# Altium schematic sheet 1_AASTM32-Power.SchDoc
size A4; SheetNumber: 2; SheetTotal: 4
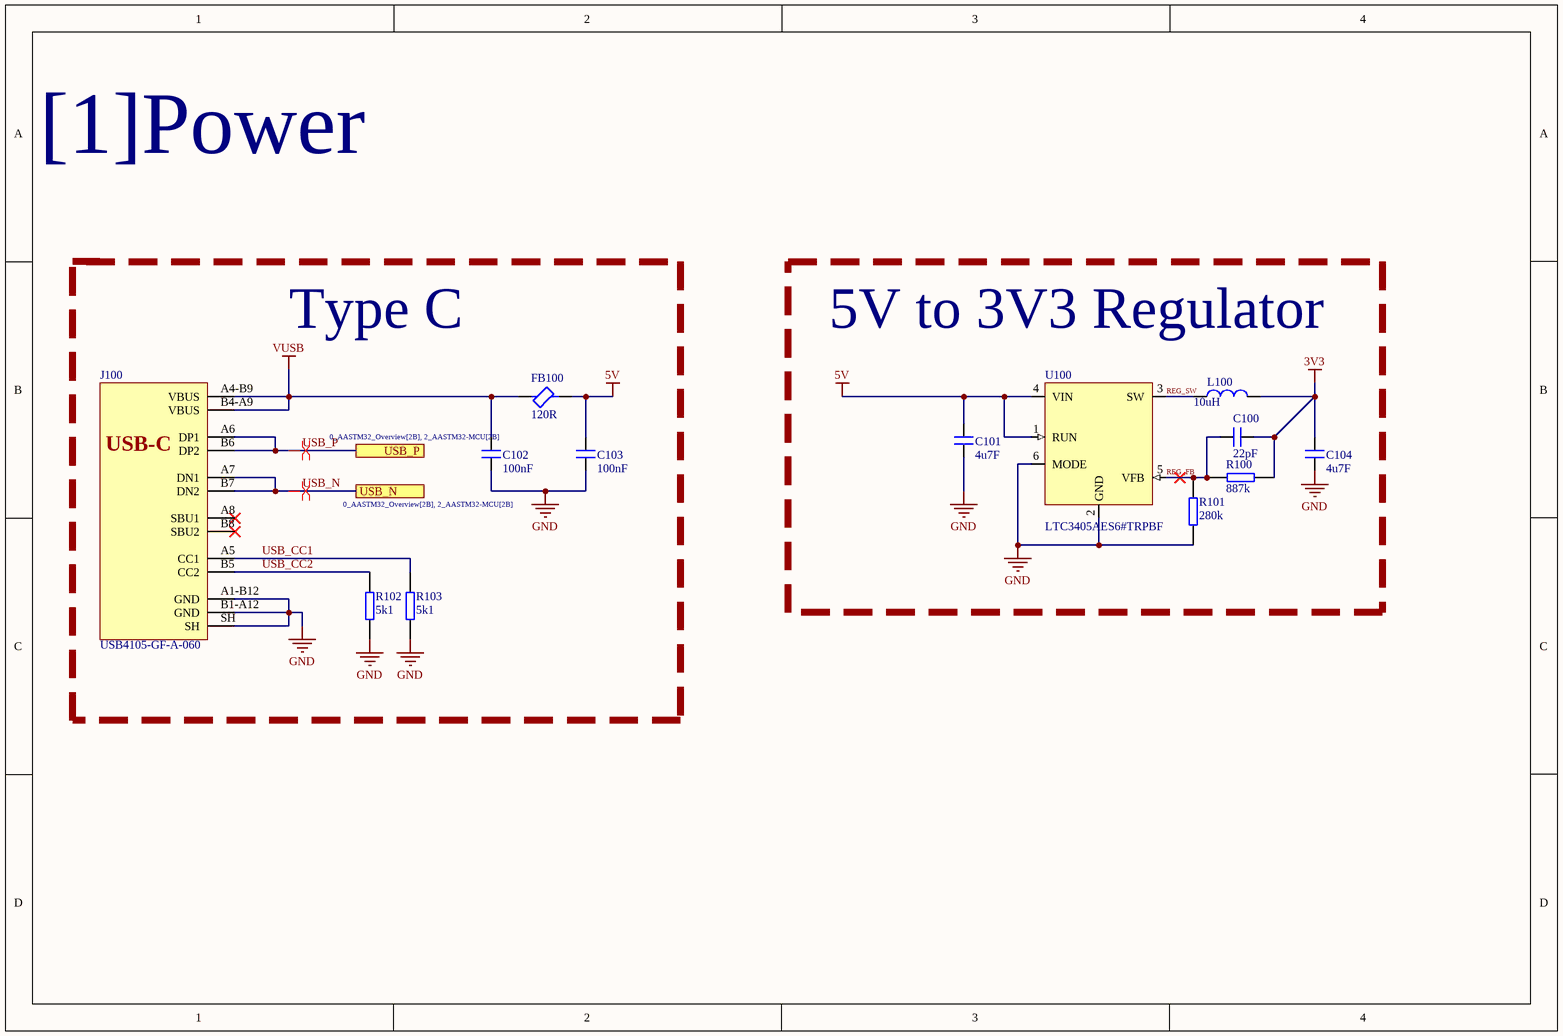
[diagram p0: 1_AASTM32-Power.SchDoc]

## Parts
C100  22pF  [0603 CAP]
C101  4u7F  [0603 CAP]
C102  100nF  [0603 CAP]
C103  100nF  [0603 CAP]
C104  4u7F  [0603 CAP]
FB100  120R  [0402 RES]
J100  USB4105-GF-A-060  [USB TYPE C GCT 16P]
L100  10uH  [NRH2412]
R100  887k  [0603 RES]
R101  280k  [0603 RES]
R102  5k1  [0603 RES]
R103  5k1  [0603 RES]
U100  LTC3405AES6#TRPBF  [SOT23-6]

## Blocks framed on the sheet
5V to 3V3 Regulator: C100 C101 C104 L100 R100 R101 U100

## Ports
USB_N (see 0_AASTM32_Overview[2B], 2_AASTM32-MCU[2B]), USB_P (see 0_AASTM32_Overview[2B], 2_AASTM32-MCU[2B])

## Nets
3V3: C100.1 C104.2 L100.2 R100.1
5V: C101.2 C103.2 FB100.2 U100.1(RUN) U100.4(VIN)
GND: C101.1 C102.1 C103.1 C104.1 J100.A1-B12(GND) J100.B1-A12(GND) J100.SH R101.1 R102.1 R103.1 U100.2(GND) U100.6(MODE)
VUSB: C102.2 FB100.1 J100.A4-B9(VBUS) J100.B4-A9(VBUS)
REG_FB: C100.2 R100.2 R101.2 U100.5(VFB)
REG_SW: L100.1 U100.3(SW)
USB_CC1: J100.A5(CC1) R103.2
USB_CC2: J100.B5(CC2) R102.2
USB_N: J100.A7(DN1) J100.B7(DN2) ; port USB_N
USB_P: J100.A6(DP1) J100.B6(DP2) ; port USB_P

Not connected (* = marked no-connect by the designer): J100 A8(SBU1)* B8(SBU2)*

## Layout directives
differential pair; differential pair class USB90: USB_N, USB_P

## Notes on the sheet
- [1]Power
- Type C
- (in symbol USB TYPE C 16 PIN GCT) USB-C

## Library data of the parts
C100-C104 = 0603 4u7 CAP: Ceramic Capacitor, Multilayer, Ceramic, 25V, 10% +Tol, 10% -Tol, X5R, 15% TC, 4.7uF, Surface Mount, 0603; Manufacturer: Samsung; Manufacturer Part Number: CL10A475KA8NQNC; Multilayer: Yes; Case: 0603; Supplier: Digikey; Supplier Part Number: 1276-1900-1-ND; RoHS: Yes; Category: Ceramic Capacitors; Stock: 1806164; Pricing: 1=0,35, 10=0,226, 50=0,1584, 100=0,1279, 500=0,09502, 1000=0,08314 (USD); Mounting Technology: Surface Mount; Pins: 2; Package Shape: Rectangular; Terminal Finish: Nickel; Dielectric Material: Ceramic; Case/Package: 0603; Min Operating Temperature: -55°C; Max Operating Temperature: 85°C; JESD-609 Code: e3; Package Style: SMTMeter; Value: 4.7uF; Capacitor Type: Ceramic; Tolerance  (fill in as +-): 10%; Packaging: Tape and Reel; Tolerance (fill in as +-): 10%; Rated DC Voltage (URdc): 25V; Temperature Characteristics Code: X5R; Termination: Wraparound; Length: 1.6mm; Width: 0.8mm; Height: 0.95mm; Reach SVHC Compliant: Yes; RoHS Compliant: Yes; ComponentLink1URL: https://datasheet.ciiva.com:443/pdfs/VipMasterIC/IC/SEMS/SEMS-S-A0008384515/SEMS-S-A0008873295-1.pdf?src-supplier=IHS+Markit; ComponentLink1Description: https://datasheet.ciiva.com:443/pdfs/VipMasterIC/IC/SEMS/SEMS-S-A0008384515/SEMS-S-A0008873295-1.pdf?src-supplier=IHS+Markit; ComponentLink2URL: https://datasheet.ciiva.com/25787/cl10a475ka8nqnc-25787017.pdf?src-supplier=Digikey; ComponentLink2Description: https://datasheet.ciiva.com/25787/cl10a475ka8nqnc-25787017.pdf?src-supplier=Digikey
FB100 = Ferritte Bead 120R 0402: Ferrite Chip, 1 Function(s), 0.9A, 2 Pin(s) / BLM15PD121SN1D; Manufacturer: Murata; DC Resistance-Max: 90mR; Clock Frequency: 100MHz; Channels: 1; Current Rating: 900mA; Supplier: Digikey; Supplier Part Number: 490-5203-6-ND; Manufacturer Part Number: BLM15PD121SN1D; RoHS: Yes; Category: Ferrite Beads and Chips; Stock: 709858; Pricing: 1=0,1, 10=0,068, 25=0,0616, 50=0,0556, 100=0,0408, 250=0,02968, 500=0,0272, 1000=0,02348, 5000=0,01854 (USD); Mounting Technology: Surface Mount; Material: Ferrite; Case Code: 0402; Terminal Finish: Nickel; Min Operating Temperature: -55°C; Max Operating Temperature: 125°C; JESD-609 Code: e3; Construction: Chip Bead; Filter Type: FERRITE CHIP; Min Frequency: 100MHz; Output Impedance: 120R; Packaging: Tape and Reel; Length: 1mm; Width: 0.5mm; Height: 0.5mm; Reach SVHC Compliant: Yes; RoHS Compliant: Yes; ComponentLink1URL: https://datasheet.ciiva.com:443/pdfs/VipMasterIC/IC/MURE/MURE-S-A0010009827/MURE-S-A0010009827-1.pdf?src-supplier=IHS+Markit; ComponentLink1Description: https://datasheet.ciiva.com:443/pdfs/VipMasterIC/IC/MURE/MURE-S-A0010009827/MURE-S-A0010009827-1.pdf?src-supplier=IHS+Markit
J100 = USB TYPE C 16 PIN GCT: USB Connectors USB Type C, 2.0 SMT PCB Top Mnt .60mm; Manufacturer: GCT; Voltage Rating: 5V; Current Rating: 5A; Manufacturer Part Number: USB4105-GF-A-060
L100 = NRH2412T100MNGH: Power Inductors - SMD 963-LSXNE2424MKT100M RPLCMT PN 2412 10uH 600mOhms; Manufacturer: TAIYO YUDEN; Manufacturer Part Number: NRH2412T100MNGH
R100 R101 = 0603 680R RES: Case: 0603
R102 R103 = 0603 10k RES: Case: 0603
U100 = LTC3405AES6#TRPBF: 1.5MHz, 300mA Synchronous Step-Down Regulator in ThinSOT; Manufacturer: Analog Devices; Manufacturer Part Number: LTC3405AES6#TRPBF